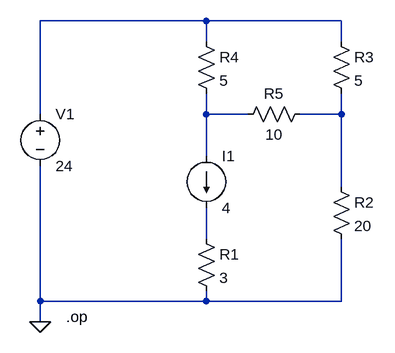
[diagram p0: schematic CH03-KP1-10.asc]
CH03-KP1-10.asc, the LTspice schematic file:
Version 4
SHEET 1 880 680
WIRE 192 176 -64 176
WIRE 400 176 192 176
WIRE 192 208 192 176
WIRE 400 208 400 176
WIRE -64 320 -64 176
WIRE 192 320 192 288
WIRE 256 320 192 320
WIRE 400 320 400 288
WIRE 400 320 336 320
WIRE 192 384 192 320
WIRE 400 432 400 320
WIRE 192 512 192 464
WIRE -64 608 -64 400
WIRE 192 608 192 592
WIRE 192 608 -64 608
WIRE 400 608 400 512
WIRE 400 608 192 608
WIRE -64 640 -64 608
FLAG -64 640 0
SYMBOL voltage -64 304 R0
SYMATTR InstName V1
SYMATTR Value 24
SYMBOL current 192 384 R0
SYMATTR InstName I1
SYMATTR Value 4
SYMBOL res 176 496 R0
SYMATTR InstName R1
SYMATTR Value 3
SYMBOL res 384 416 R0
SYMATTR InstName R2
SYMATTR Value 20
SYMBOL res 384 192 R0
SYMATTR InstName R3
SYMATTR Value 5
SYMBOL res 176 192 R0
SYMATTR InstName R4
SYMATTR Value 5
SYMBOL res 352 304 R90
WINDOW 0 0 56 VBottom 2
WINDOW 3 32 56 VTop 2
SYMATTR InstName R5
SYMATTR Value 10
TEXT -24 632 Left 2 !.op

The netlist it stands for:
* CH03-KP1-10.asc
V1 N001 0 24
I1 N002 N004 4
R1 N004 0 3
R2 N003 0 20
R3 N001 N003 5
R4 N001 N002 5
R5 N003 N002 10
.op
.backanno
.end